# EasyEDA Pro project ProPrj_Altruist.epro, schematic Schematic noise
Board Name: Noize; Create Date: 2024-12-26; Page Name: Noize; Project Name: Altruist rc: v0.1.1; Schematic Name: Schematic noize; Update Date: 2024-12-27; Company: Robonomics.network; Drawn: chegurov; Page Size: A5; Part Number: Robo_altruist; Reviewed: ludovich88; Version: V0.1
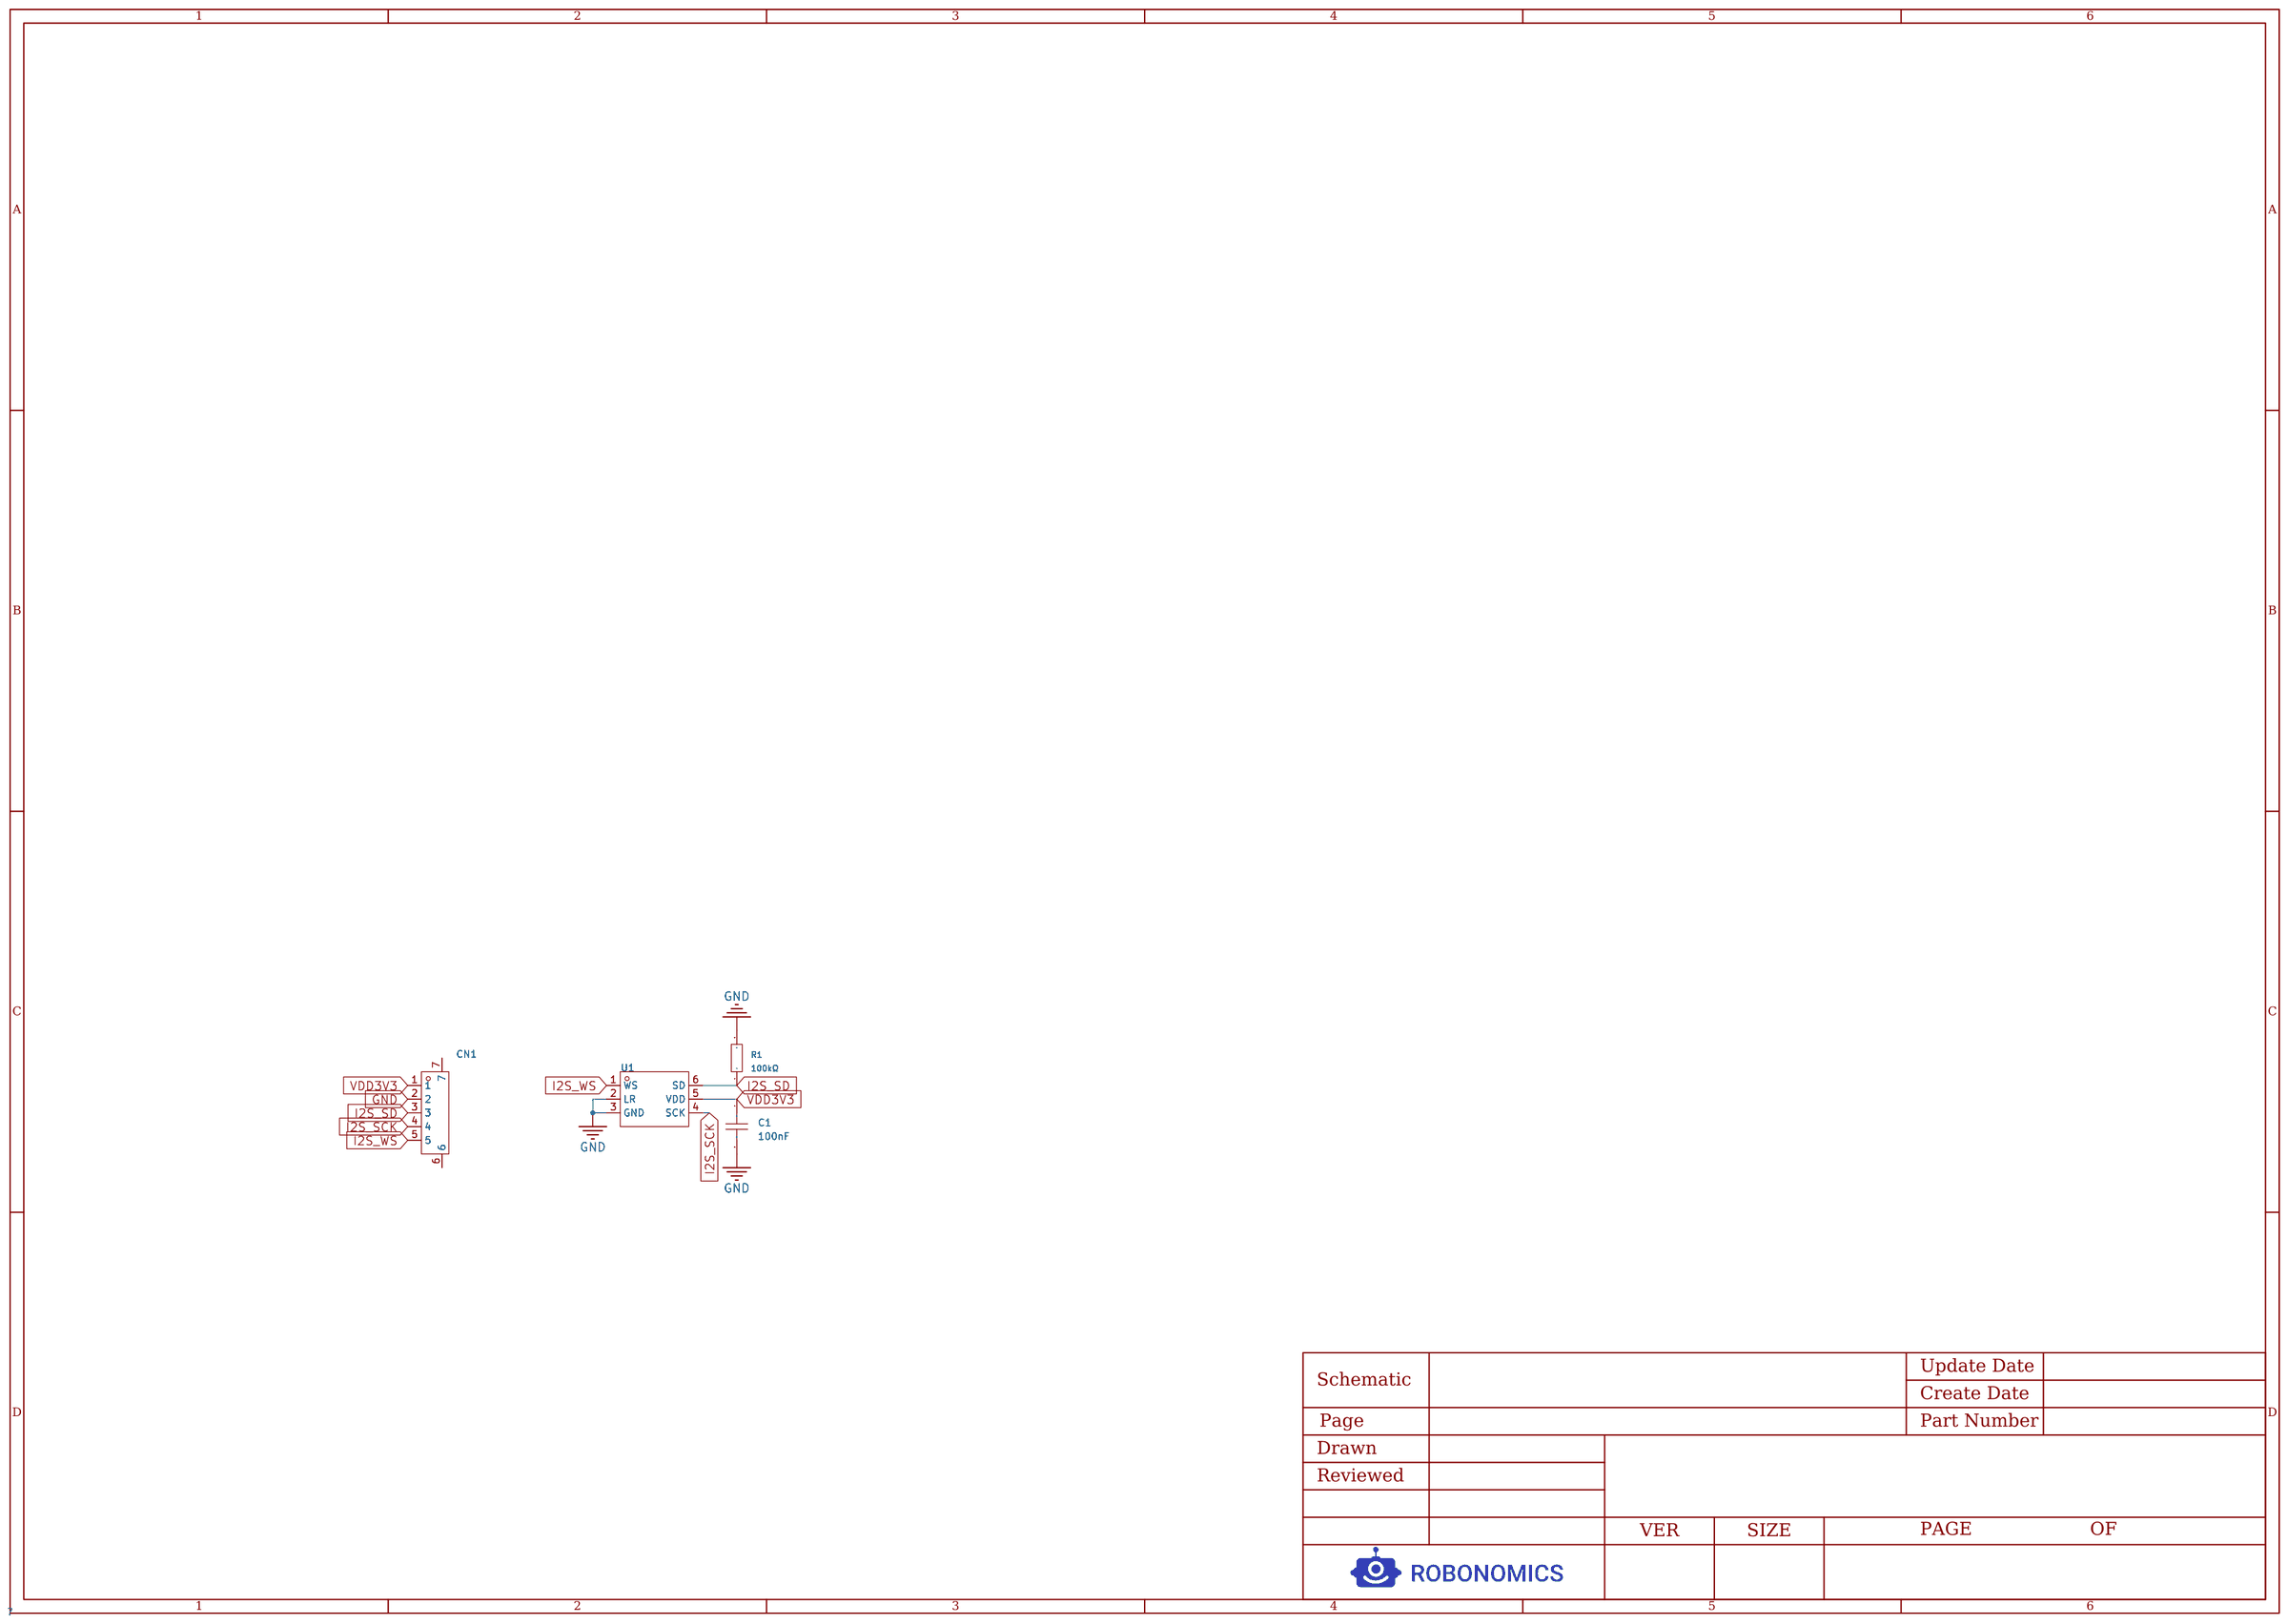
[diagram p0: schematic sheet]

## Parts
C1  100nF  [C0402]
CN1  ZX-ZH1.5-5PWT  [CONN-SMD_5P-P1.50_ZX-ZH1.5-5PWT]
R1  100kΩ  [R0402]
U1  ICS-43434  [MIC-SMD_6P-L3.5-W2.7-P0.90-BL]

## Library data of the parts
C1 = 0402B104K500CT: Capacitance: Tolerance:±10% Tolerance:±10% Voltage Rated: Temperature Coefficient:; LCSC Part Name: 100nF ±10% 50V; Supplier Part: C152814; Manufacturer: Walsin(华新科); Supplier Footprint: 0402; JLCPCB Part Class: Extended Part; Datasheet: https://atta.szlcsc.com/upload/public/pdf/source/20191217/C469650_84AD5C6F618CF4AC0C6D987F2E8FE6F8.pdf; Supplier: LCSC; Tolerance: ±10%
CN1 = ZX-ZH1.5-5PWT: Pins Structure:1x5P Pitch:1.5mm Mounting Style:Horizontal attachment Reference Series:ZH Number of Pins:5P Number of Rows:1 Number of PINs Per Row:5 Row Spacing:- Current Rating (Max):1A Contact Material:Brass Contact Plating:Tin Operating Temperature Ran; LCSC Part Name: 1x5P 间距:1.5mm 卧贴 系列:ZH; Supplier Part: C19272408; Manufacturer: Megastar(兆星); Supplier Footprint: SMD,P=1.5mm,卧贴; Datasheet: https://atta.szlcsc.com/upload/public/pdf/source/20231201/C5A824B953C40A6060EBF5A541254C86.pdf; Supplier: LCSC; Pins Structure: 1x5P; Pitch: 1.5mm; Mounting Style: Horizontal attachment; Reference Series: ZH; Number of Pins: 5P; Number of Rows: 1; Number of PINs Per Row: 5; Current Rating (Max): 1A; Contact Material: Brass; Contact Plating: Tin; Operating Temperature Range: -25℃~+85℃
R1 = 0402WGF1003TCE: Type:Thick Film Resistors Resistance:100kΩ Tolerance:±1% Tolerance:±1% Power(Watts): Overload Voltage (Max): Temperature Coefficient:±100ppm/℃ Temperature Coefficient:±100ppm/℃ Operating Temperature Range:-55℃~+155℃ Operating Temperature Range:-55℃~+155℃; LCSC Part Name: 100kΩ ±1% 62.5mW 厚膜电阻; Supplier Part: C25741; Manufacturer: UNI-ROYAL(厚声); Supplier Footprint: 0402; Datasheet: https://atta.szlcsc.com/upload/public/pdf/source/20200306/C422600_1E6D84923E4A46A82E41ADD87F860B5C.pdf; Supplier: LCSC; Type: Thick Film Resistors; Tolerance: ±1%; Temperature Coefficient: ±100ppm/℃; Operating Temperature Range: -55℃~+155℃
U1 = ICS-43434_C5656610: Direction:全指向 Supply Voltage:1.65V~3.63V Supply Voltage:1.65V~3.63V Current Consumption:550uA Current Consumption:550uA SNR(Signal to Noise Ratio):64dB Sensitivity:- Sensitivity:-; Supplier Part: C5656610; Manufacturer: TDK InvenSense(应美盛); Datasheet: https://atta.szlcsc.com/upload/public/pdf/source/231023/DS-000069-ICS-43434-v1.2-8194c7772d771e21a553109502704f97.pdf; Supplier: LCSC; Direction: 全指向; Supply Voltage: 1.65V~3.63V; Current Consumption: 550uA; SNR(Signal to Noise Ratio): 64dB

## Nets
GND: C1.2 CN1.2 R1.2 U1.2(LR) U1.3(GND)
VDD3V3: C1.1 CN1.1 U1.5(VDD)
I2S_SCK: CN1.4 U1.4(SCK)
I2S_SD: CN1.3 R1.1 U1.6(SD)
I2S_WS: CN1.5 U1.1(WS)

Not connected (* = marked no-connect by the designer): CN1 6 7
